# Altium schematic sheet Sheet_ConnectA10.SchDoc: Sheet_ConnectA10
size A4; Organization: Altium Limited; Address1: L3, 12a Rodborough Rd; Address2: Frenchs Forest; Address3: NSW; Address4: Australia 2086
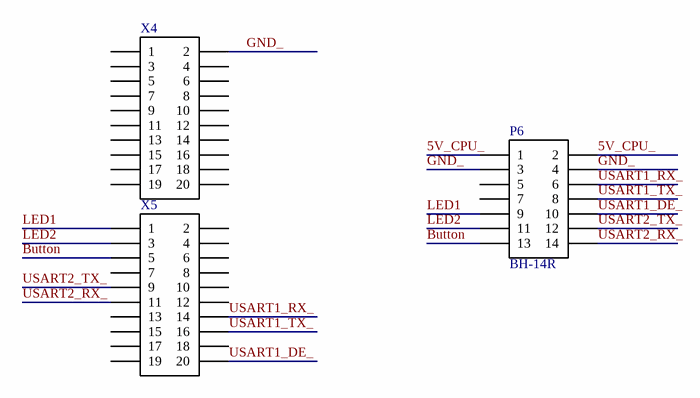
[diagram p0: Sheet_ConnectA10.SchDoc]

## Parts
P6  BH-14R  [BH-14R]
X4  PBD2-20  [PBD2-1.27-20-SMD]  (value not drawn)
X5  PBD2-20  [PBD2-1.27-20-SMD]  (value not drawn)

## Nets
5V_CPU_: P6.1 P6.2
Button: P6.13 X5.5
GND_: P6.3 P6.4 X4.2
LED1: P6.9 X5.1
LED2: P6.11 X5.3
USART1_DE_: P6.10 X5.20
USART1_RX_: P6.6 X5.14
USART1_TX_: P6.8 X5.16
USART2_RX_: P6.14 X5.11
USART2_TX_: P6.12 X5.9

Not connected (* = marked no-connect by the designer): P6 5 7; X4 1 3 4 5 6 7 8 9 10 11 12 13 14 15 16 17 18 19 20; X5 2 4 6 7 8 10 12 13 15 17 18 19

## Notes on the sheet
- Title
- Size:
- Date:
- A4
- Number:
- Time:
- Revision:
- Sheet
- of
- File:

## Library data of the parts
P6 = BH-14: IDC/BH; LatestRevisionDate: 17-Jul-2002; LatestRevisionNote: Re-released for DXP Platform.; Publisher: Altium Limited
X4 X5 = PBD2-20: Header, 20-Pin